# EAGLE schematic chipKIT Max32 (EAGLE 6.4)

## Sheet 1 of 5
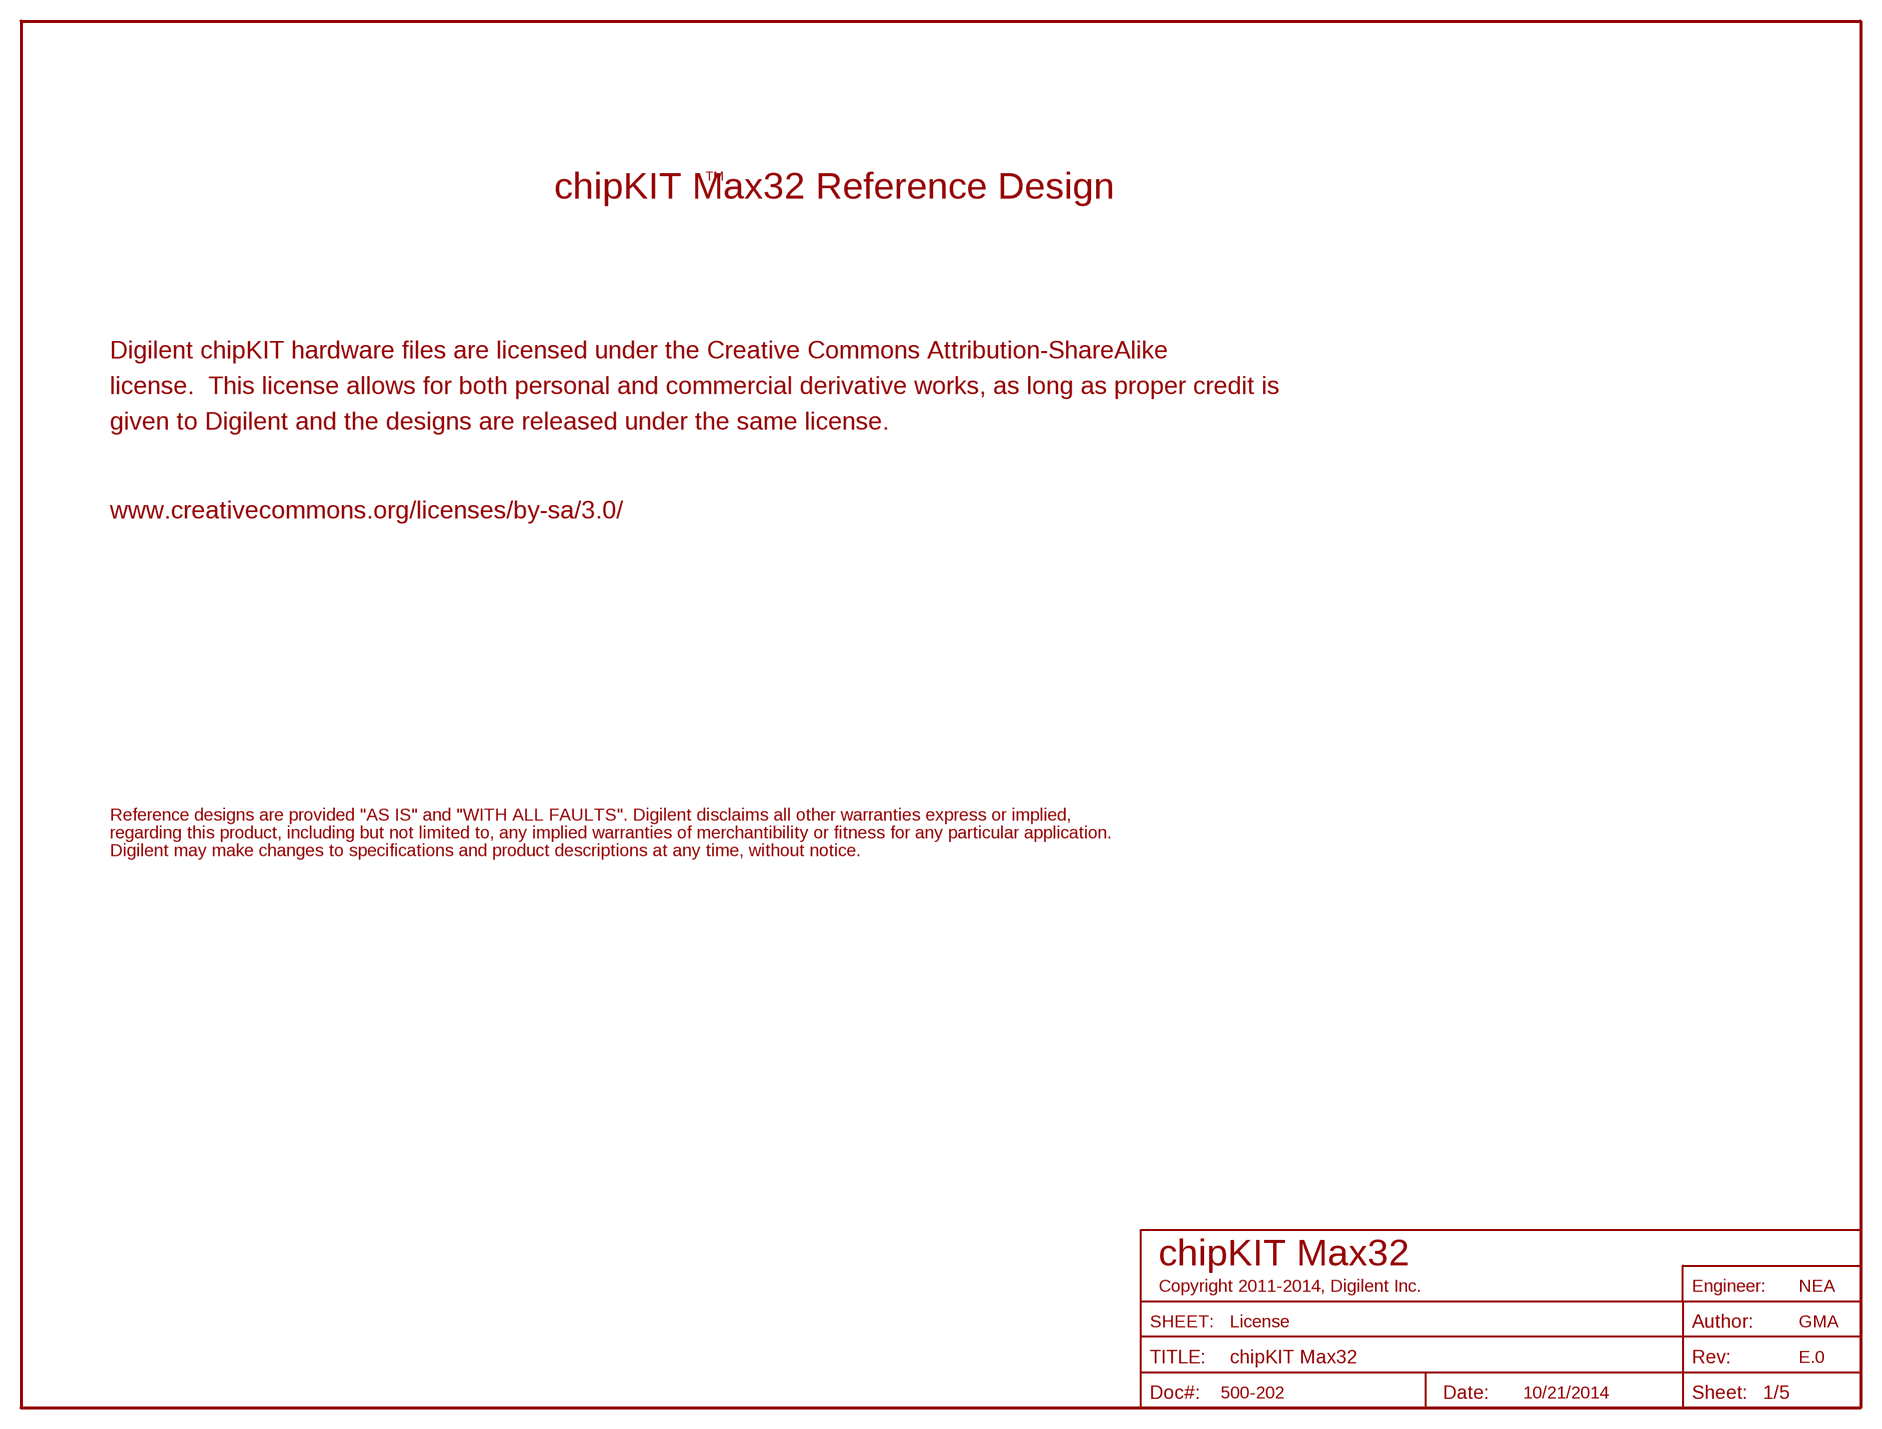
[diagram p0: schematic, sheet 1]

### Notes on the sheet
- TM
- chipKIT Max32 Reference Design
- Digilent chipKIT hardware files are licensed under the Creative Commons Attribution-ShareAlike
- license.  This license allows for both personal and commercial derivative works, as long as proper credit is
- given to Digilent and the designs are released under the same license.
- www.creativecommons.org/licenses/by-sa/3.0/
- Reference designs are provided "AS IS" and "WITH ALL FAULTS". Digilent disclaims all other warranties express or implied,
- regarding this product, including but not limited to, any implied warranties of merchantibility or fitness for any particular application.
- Digilent may make changes to specifications and product descriptions at any time, without notice.
- chipKIT Max32
- Copyright 2011-2014, Digilent Inc. | NEA
- License | GMA
- E.0
- 500-202 | 10/21/2014

## Sheet 2 of 5
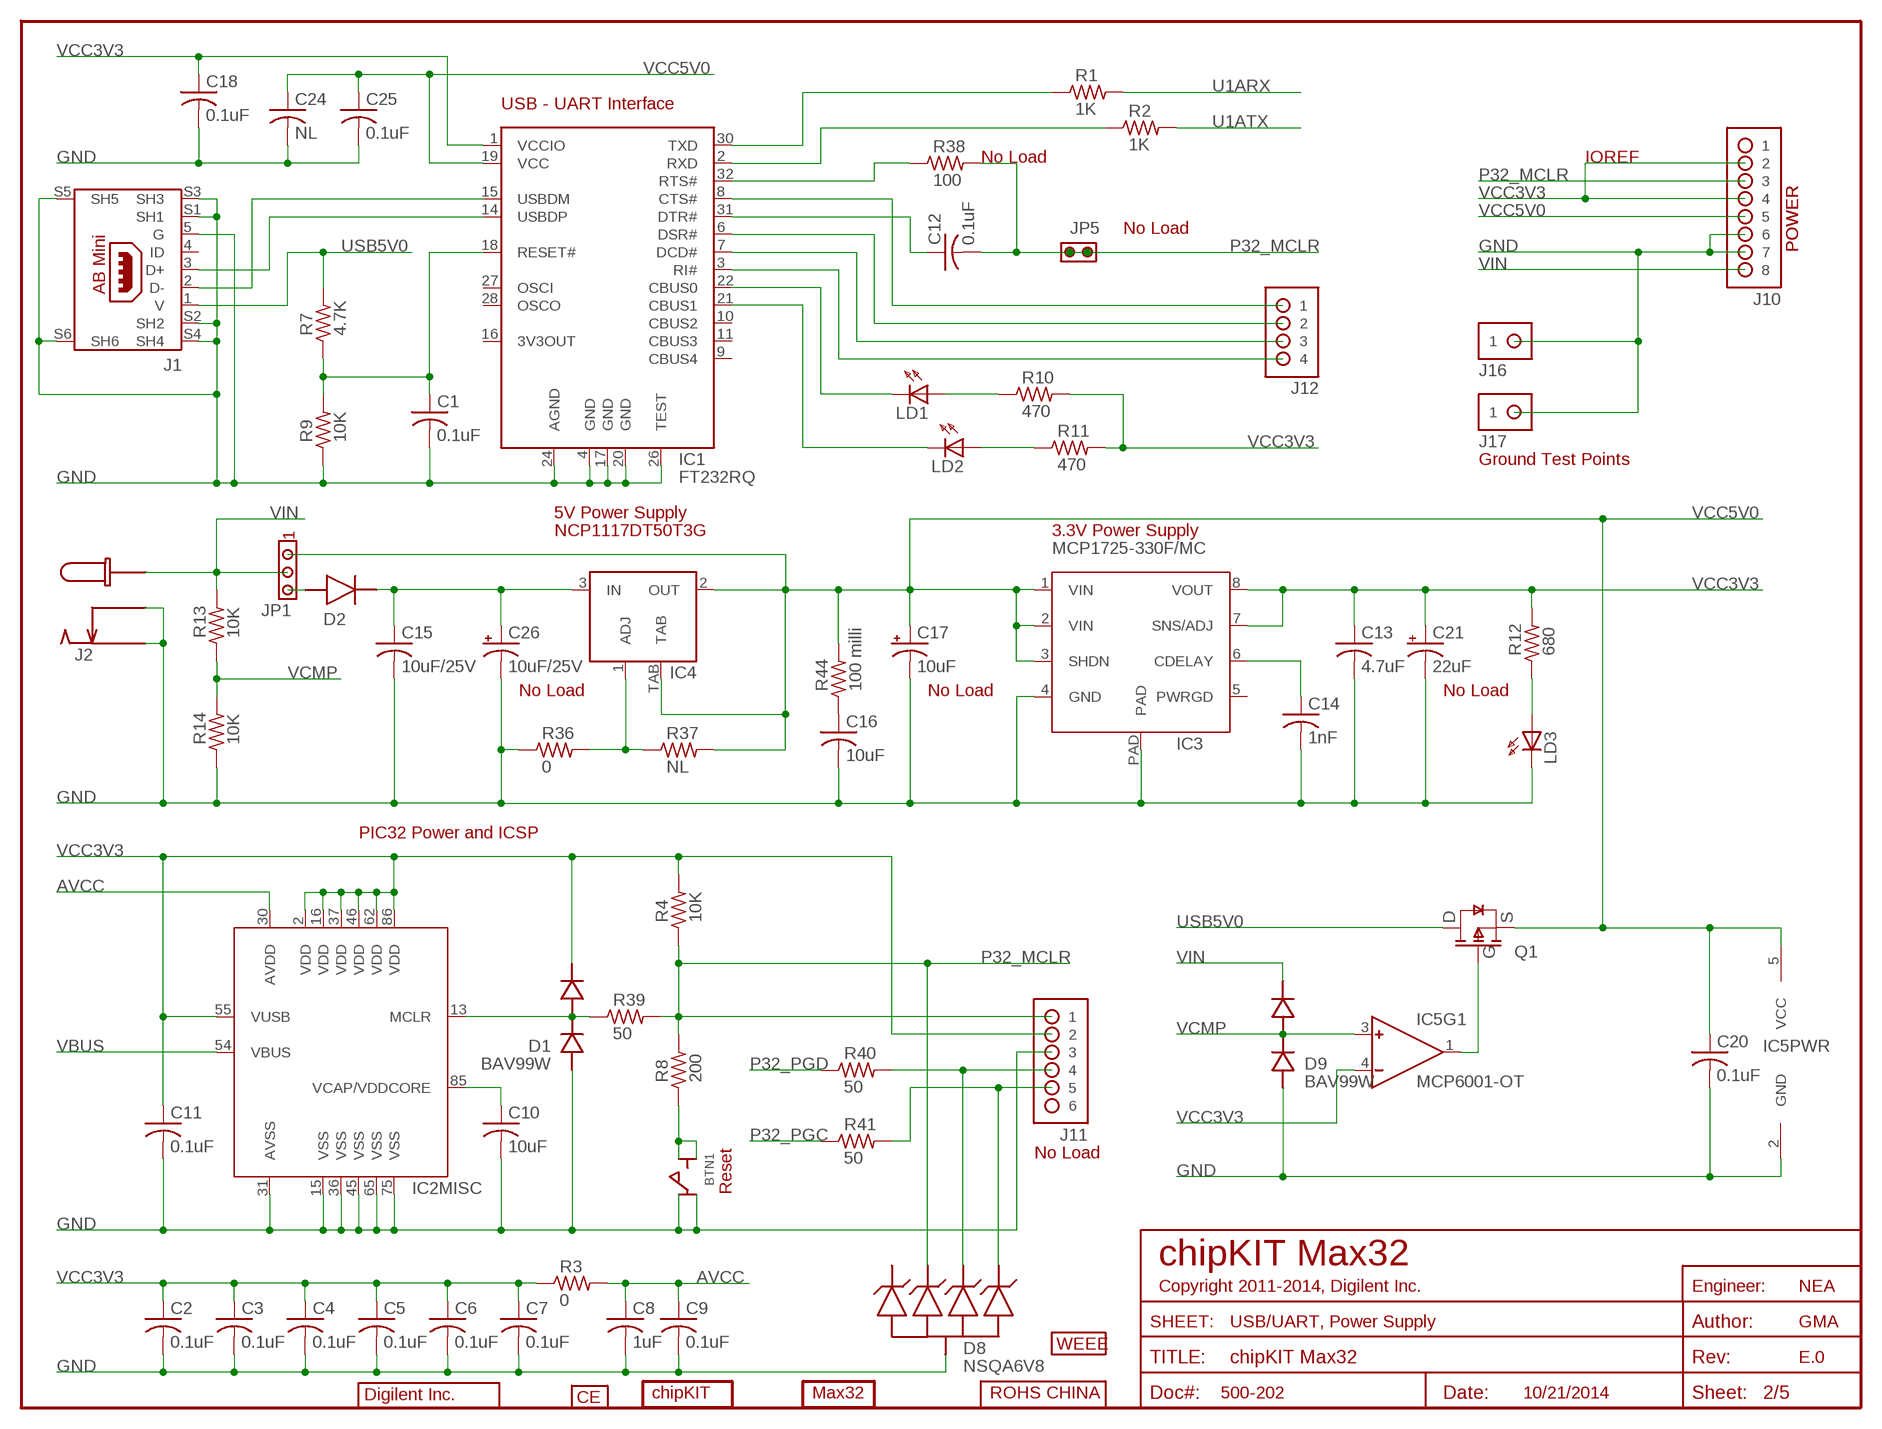
[diagram p1: schematic, sheet 2]

### Parts
BTN1  SW-P8008  [SW-P8008]
C1  0.1uF  CAP-S0402S  [C0402S]
C2  0.1uF  CAP-S0402S  [C0402S]
C3  0.1uF  CAP-S0402S  [C0402S]
C4  0.1uF  CAP-S0402S  [C0402S]
C5  0.1uF  CAP-S0402S  [C0402S]
C6  0.1uF  CAP-S0402S  [C0402S]
C7  0.1uF  CAP-S0402S  [C0402S]
C8  1uF  CAP-S0402S  [C0402S]
C9  0.1uF  CAP-S0402S  [C0402S]
C10  10uF  CAP-S0603S  [C0603S]
C11  0.1uF  CAP-S0402S  [C0402S]
C12  0.1uF  CAP-S0402S  [C0402S]
C13  4.7uF  CAP-S0603S  [C0603S]
C14  1nF  CAP-S0402S  [C0402S]
C15  10uF/25V  CAP-S0805S  [C0805S]
C16  10uF  CAP-S0603S  [C0603S]
C17  10uF  CPOL-SA  [CPOL3216]
C18  0.1uF  CAP-S0402S  [C0402S]
C20  0.1uF  CAP-S0402  [C0402]
C21  22uF  CPOL-SA  [CPOL3216]
C24  NL  CAP-S0603S  [C0603S]
C25  0.1uF  CAP-S0402S  [C0402S]
C26  10uF/25V  CPOL-SA  [CPOL3216]
D1  BAV99W  [SOT-323]
D2  B220A  DIODESMA  [SMA]
D8  NSQA6V8  [SOT-323-5]
D9  BAV99W  [SOT-323]
IC1  FT232RQ  [QFN32]
IC2  PIC32MX7X5FL-PT  [TQ100-PT]
IC3  MCP1725-330F/MC  MCP1725MC  [DFN8-MC]
IC4  NCP1117DT50T3G  LM1117MP  [SOT223]
IC5  MCP6001-OT  [SOT23-5-OT]
J1  USB-AB-MINI  [USB-AB-MINI]
J2  CON-COAX-KLD0202-S  [KLD-0202S]
J10  ST Female  HDR-1X8  [HDR-1X8]
J11  No Load  HDR-1X6-OFFSET  [HDR-1X6_OFFSET]
J12  HDR-1X4  [HDR-1X4]
J16  HDR-1X1  [HDR-1X1]
J17  HDR-1X1  [HDR-1X1]
JP1  JPR-1X3  [JPR-1X3]
JP5  No Load  JPR-1X2  [JPR-1X2]
LD1  LED-S0603-RED  LED-S0603  [D0603]
LD2  LED-S0603-RED  LED-S0603  [D0603]
LD3  LED-S0603-RED  LED-S0603  [D0603]
LOGO1  ROHS-CHINA-INV  [ROHS_CHINA_INV_LOGO]
LOGO2  WEEE-L  [WEEE_LOGO2]
LOGO4  MAX32_LOGO  [MAX32_LOGO]
LOGO5  CHIPKIT  [CHIPKIT_LOGO]
LOGO6  CE  [CE_LOGO]
LOGO7  DIGILENT_INC-BT-1500  [DIGILENT_BEYOND_1500_LOGO]
Q1  FDN340P  [SOT23]
R1  1K  RES-S0402S  [R0402S]
R2  1K  RES-S0402S  [R0402S]
R3  0  RES-S0603  [R0603]
R4  10K  RES-S0402S  [R0402S]
R7  4.7K  RES-S0402S  [R0402S]
R8  200  RES-S0402S  [R0402S]
R9  10K  RES-S0402S  [R0402S]
R10  470  RES-S0402S  [R0402S]
R11  470  RES-S0402S  [R0402S]
R12  680  RES-S0402S  [R0402S]
R13  10K  RES-S0402S  [R0402S]
R14  10K  RES-S0402S  [R0402S]
R36  0  RES-S0402S  [R0402S]
R37  NL  RES-S0402S  [R0402S]
R38  100  RES-S0402S  [R0402S]
R39  50  RES-S0402S  [R0402S]
R40  50  RES-S0402S  [R0402S]
R41  50  RES-S0402S  [R0402S]
R44  100 milli  RES-S0603S  [R0603S]

### Nets
AVCC: C8.1 C9.1 IC2.30(MISC:AVDD) R3.2
GND: BTN1.1A BTN1.2A C1.2 C2.2 C3.2 C4.2 C5.2 C6.2 C7.2 C8.2 C9.2 C10.2 C11.2 C13.2 C14.2 C15.2 C16.2 C17.- C18.2 C20.2 C21.- C24.2 C25.2 C26.- D1.1(CAT) D8.2(COM) D9.1(CAT) IC1.4(GND) IC1.17(GND) IC1.20(GND) IC1.24(AGND) IC1.26(TEST) IC2.15(MISC:VSS) IC2.31(MISC:AVSS) IC2.36(MISC:VSS) IC2.45(MISC:VSS) IC2.65(MISC:VSS) IC2.75(MISC:VSS) IC3.4(GND) IC3.PAD IC5.2(PWR:GND) J1.5(G) J1.S1(SH1) J1.S2(SH2) J1.S3(SH3) J1.S4(SH4) J1.S5(SH5) J1.S6(SH6) J2.2 J2.3 J10.6 J10.7 J11.3 J16.1 J17.1 LD3.C R9.1 R14.1 R36.1 ; also sheet 3,5
N$1: IC1.14(USBDP) J1.3(D+)
N$2: IC1.15(USBDM) J1.2(D-)
N$3: IC4.1(ADJ) R36.2 R37.1
N$4: IC1.30(TXD) R1.1
N$5: C10.1 IC2.85(MISC:VCAP/VDDCORE)
N$6: IC1.2(RXD) R2.1
N$8: C12.1 IC1.31(DTR#)
N$9: BTN1.1B BTN1.2B R8.1
N$10: IC1.8(CTS#) J12.1
N$13: IC1.6(DSR#) J12.2
N$14: IC1.7(DCD#) J12.3
N$15: IC1.3(RI#) J12.4
N$17: IC1.22(CBUS0) LD1.C
N$18: IC1.21(CBUS1) LD2.C
N$19: LD2.A R11.1
N$20: LD1.A R10.1
N$21: C14.1 IC3.6(CDELAY)
N$22: LD3.A R12.1
N$23: D2.A JP1.3
N$24: IC5.1(OUT) Q1.1(G)
N$26: C15.1 C26.+ D2.C IC4.3(IN)
N$29: C16.1 R44.1
N$30: C1.1 IC1.18(RESET#) R7.1 R9.2
N$31: D8.4(D3) J11.4 R40.2
N$32: IC1.32(RTS#) R38.1
N$33: D8.5(D4) J11.5 R41.2
N$38: D1.3(COM) IC2.13(MISC:MCLR) R39.1
P32_MCLR: C12.2 D8.3(D2) J10.3 J11.1 JP5.1 JP5.2 R4.1 R8.2 R38.2 R39.2
P32_PGC: R41.1 ; also sheet 3
P32_PGD: R40.1 ; also sheet 3
U1ARX: R1.2 ; also sheet 4,5
U1ATX: R2.2 ; also sheet 4,5
USB5V0: J1.1(V) Q1.3(D) R7.2
VBUS: IC2.54(MISC:VBUS) ; also sheet 5
VCC3V3: C2.1 C3.1 C4.1 C5.1 C6.1 C7.1 C11.1 C13.1 C18.1 C21.+ D1.2(AN) IC1.1(VCCIO) IC2.2(MISC:VDD) IC2.16(MISC:VDD) IC2.37(MISC:VDD) IC2.46(MISC:VDD) IC2.55(MISC:VUSB) IC2.62(MISC:VDD) IC2.86(MISC:VDD) IC3.7(SNS/ADJ) IC3.8(VOUT) IC5.4(IN-) J10.2 J10.4 J11.2 R3.1 R4.2 R10.2 R11.2 R12.2 ; also sheet 3,5
VCC5V0: C17.+ C20.1 C24.1 C25.1 IC1.19(VCC) IC3.1(VIN) IC3.2(VIN) IC3.3(SHDN) IC4.2(OUT) IC4.TAB IC5.5(PWR:VCC) J10.5 JP1.1 Q1.2(S) R37.2 R44.2 ; also sheet 5
VCMP: D9.3(COM) IC5.3(IN+) R13.1 R14.2
VIN: D9.2(AN) J2.1 J10.8 JP1.2 R13.2
Unconnected: D8.1(D1) IC1.9(CBUS4) IC1.10(CBUS2) IC1.11(CBUS3) IC1.16(3V3OUT) IC1.27(OSCI) IC1.28(OSCO) IC3.5(PWRGD) J1.4(ID) J10.1 J11.6

### Notes on the sheet
- USB - UART Interface
- No Load | IOREF
- No Load
- POWER | POWER
- Ground Test Points
- 5V Power Supply
- NCP1117DT50T3G | 3.3V Power Supply
- No Load | No Load | No Load
- PIC32 Power and ICSP
- No Load
- Reset
- chipKIT Max32
- Copyright 2011-2014, Digilent Inc. | NEA
- USB/UART, Power Supply | GMA
- E.0
- 500-202 | 10/21/2014

## Sheet 3 of 5
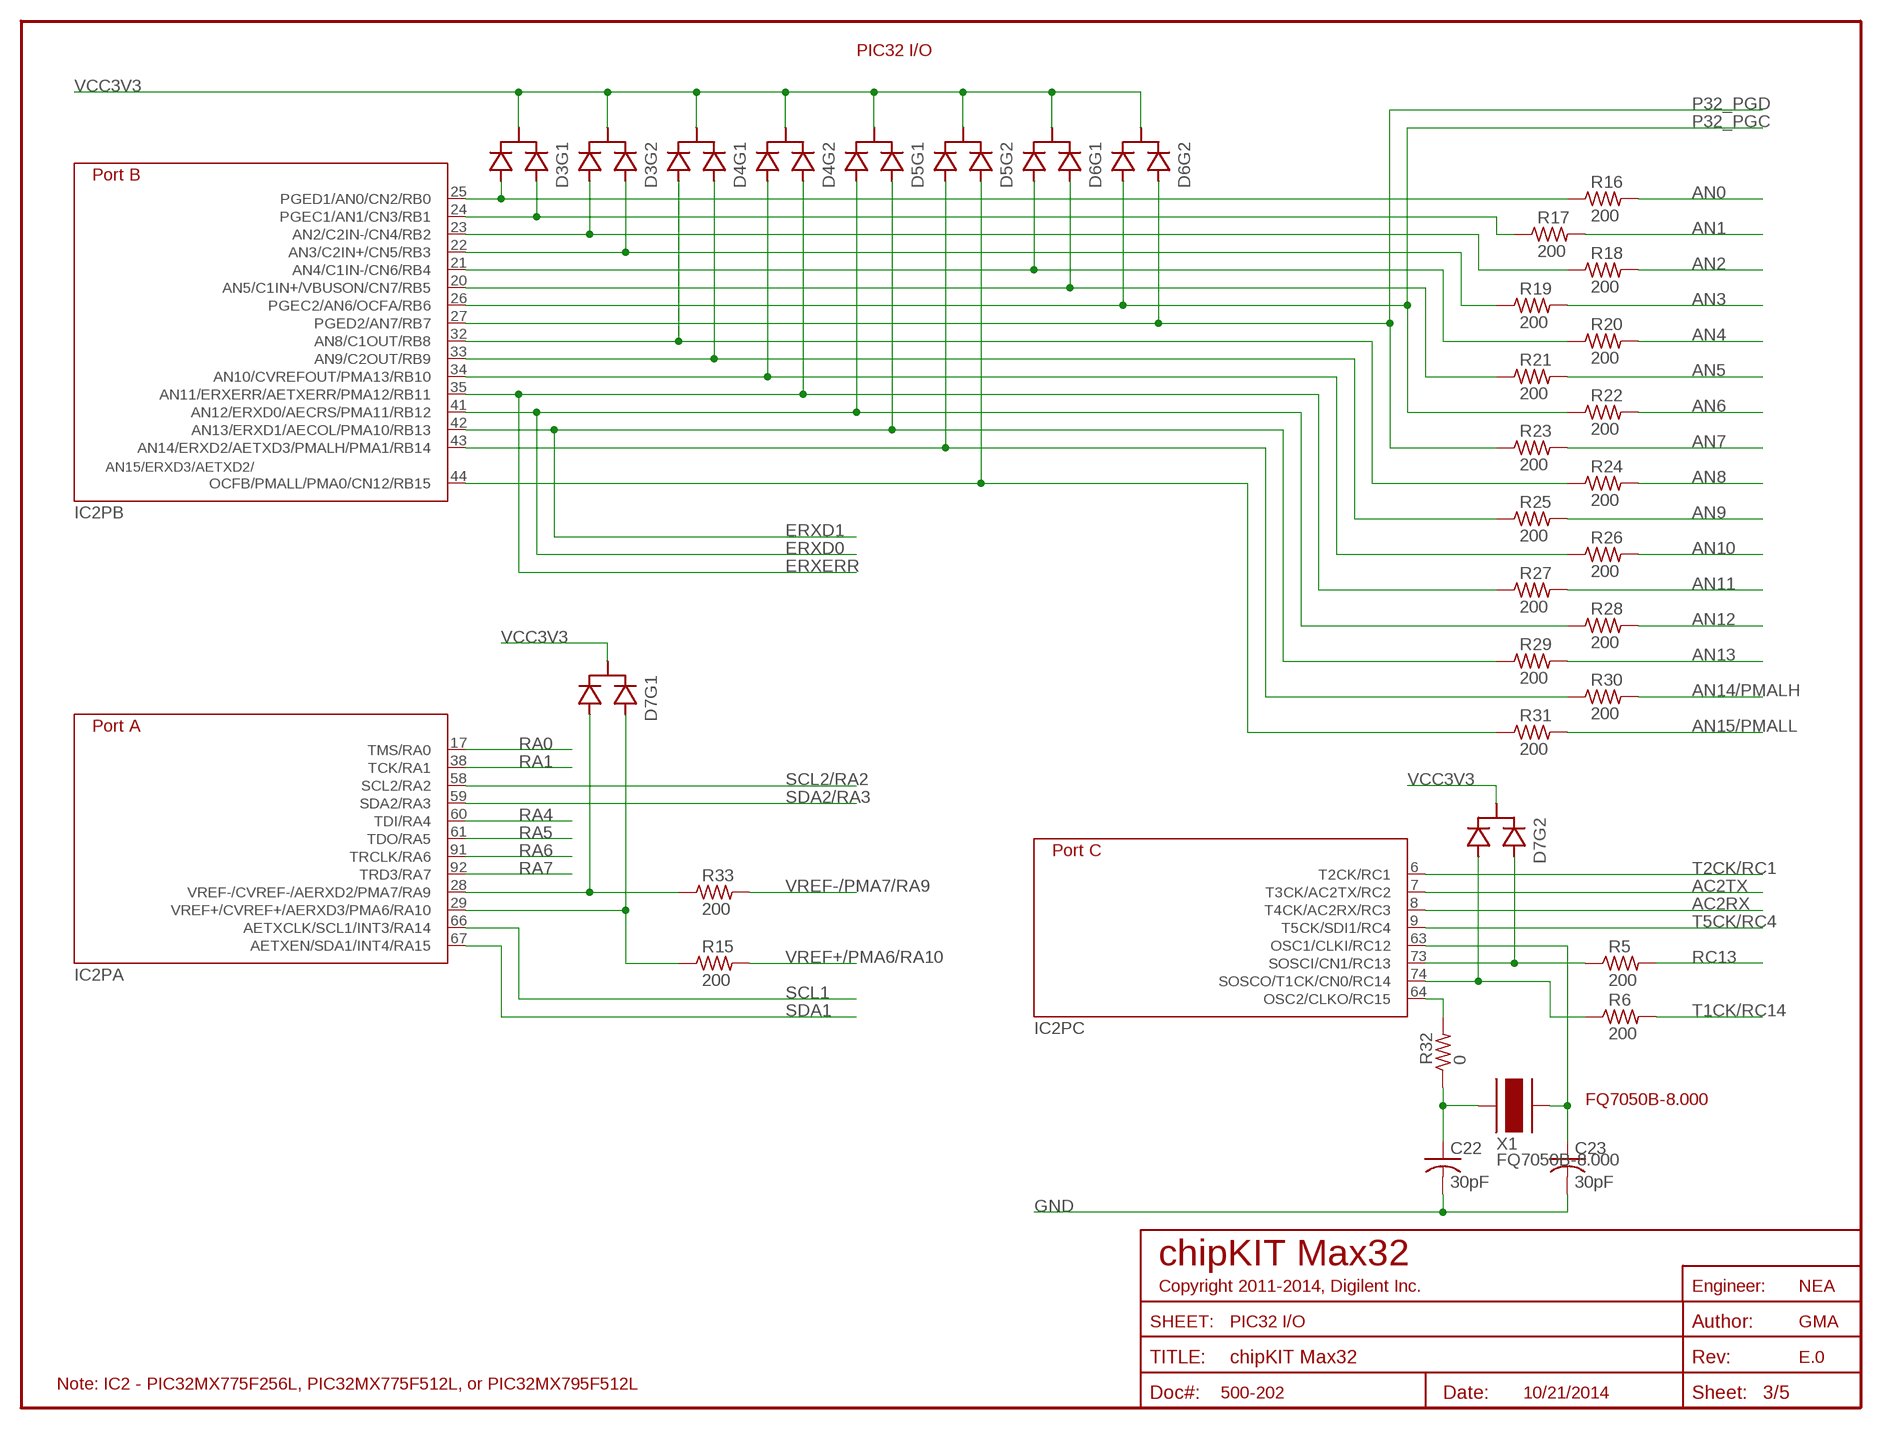
[diagram p2: schematic, sheet 3]

### Parts
C22  30pF  CAP-S0402S  [C0402S]
C23  30pF  CAP-S0402S  [C0402S]
D3  BAV70S  [SOT-363]
D4  BAV70S  [SOT-363]
D5  BAV70S  [SOT-363]
D6  BAV70S  [SOT-363]
D7  BAV70S  [SOT-363]
R5  200  RES-S0402S  [R0402S]
R6  200  RES-S0402S  [R0402S]
R15  200  RES-S0402S  [R0402S]
R16  200  RES-S0402S  [R0402S]
R17  200  RES-S0402S  [R0402S]
R18  200  RES-S0402S  [R0402S]
R19  200  RES-S0402S  [R0402S]
R20  200  RES-S0402S  [R0402S]
R21  200  RES-S0402S  [R0402S]
R22  200  RES-S0402S  [R0402S]
R23  200  RES-S0402S  [R0402S]
R24  200  RES-S0402S  [R0402S]
R25  200  RES-S0402S  [R0402S]
R26  200  RES-S0402S  [R0402S]
R27  200  RES-S0402S  [R0402S]
R28  200  RES-S0402S  [R0402S]
R29  200  RES-S0402S  [R0402S]
R30  200  RES-S0402S  [R0402S]
R31  200  RES-S0402S  [R0402S]
R32  0  RES-S0402S  [R0402S]
R33  200  RES-S0402S  [R0402S]
X1  FQ7050B-8.000  XTAL-FQ7050B  [FQ7050B]

### Nets
AC2RX: IC2.8(PC:T4CK/AC2RX/RC3) ; also sheet 5
AC2TX: IC2.7(PC:T3CK/AC2TX/RC2) ; also sheet 5
AN0: R16.2 ; also sheet 5
AN0-R: D3.1(A1) IC2.25(PB:PGED1/AN0/CN2/RB0) R16.1
AN1: R17.2 ; also sheet 5
AN1-R: D3.2(A2) IC2.24(PB:PGEC1/AN1/CN3/RB1) R17.1
AN2: R18.2 ; also sheet 5
AN3: R19.2 ; also sheet 5
AN4: R20.2 ; also sheet 5
AN5: R21.2 ; also sheet 5
AN6: R22.2 ; also sheet 5
AN7: R23.2 ; also sheet 5
AN8: R24.2 ; also sheet 5
AN9: R25.2 ; also sheet 5
AN10: R26.2 ; also sheet 5
AN11: R27.2 ; also sheet 5
AN12: R28.2 ; also sheet 5
AN13: R29.2 ; also sheet 5
AN14/PMALH: R30.2 ; also sheet 5
AN15/PMALL: R31.2 ; also sheet 5
ERXD0: D5.1(A1) IC2.41(PB:AN12/ERXD0/AECRS/PMA11/RB12) R28.1 ; also sheet 5
ERXD1: D5.2(A2) IC2.42(PB:AN13/ERXD1/AECOL/PMA10/RB13) R29.1 ; also sheet 5
ERXERR: D4.5(A2) IC2.35(PB:AN11/ERXERR/AETXERR/PMA12/RB11) R27.1 ; also sheet 5
GND: C22.2 C23.2 ; also sheet 2,5
N$7: D7.5(A2) IC2.73(PC:SOSCI/CN1/RC13) R5.1
N$11: D7.4(A1) IC2.74(PC:SOSCO/T1CK/CN0/RC14) R6.1
N$25: D7.1(A1) IC2.28(PA:VREF-/CVREF-/AERXD2/PMA7/RA9) R33.1
N$35: D7.2(A2) IC2.29(PA:VREF+/CVREF+/AERXD3/PMA6/RA10) R15.1
N$37: IC2.64(PC:OSC2/CLKO/RC15) R32.2
N$39: C22.1 R32.1 X1.1
N$40: D3.4(A1) IC2.23(PB:AN2/C2IN-/CN4/RB2) R18.1
N$41: C23.1 IC2.63(PC:OSC1/CLKI/RC12) X1.3
N$42: D3.5(A2) IC2.22(PB:AN3/C2IN+/CN5/RB3) R19.1
N$44: D6.1(A1) IC2.21(PB:AN4/C1IN-/CN6/RB4) R20.1
N$46: D6.2(A2) IC2.20(PB:AN5/C1IN+/VBUSON/CN7/RB5) R21.1
N$52: D4.1(A1) IC2.32(PB:AN8/C1OUT/RB8) R24.1
N$54: D4.2(A2) IC2.33(PB:AN9/C2OUT/RB9) R25.1
N$56: D4.4(A1) IC2.34(PB:AN10/CVREFOUT/PMA13/RB10) R26.1
N$64: D5.4(A1) IC2.43(PB:AN14/ERXD2/AETXD3/PMALH/PMA1/RB14) R30.1
N$66: D5.5(A2) IC2.44(PB:OCFB/PMALL/PMA0/CN12/RB15) R31.1
P32_PGC: D6.4(A1) IC2.26(PB:PGEC2/AN6/OCFA/RB6) R22.1 ; also sheet 2
P32_PGD: D6.5(A2) IC2.27(PB:PGED2/AN7/RB7) R23.1 ; also sheet 2
RA0: IC2.17(PA:TMS/RA0) ; also sheet 5
RA1: IC2.38(PA:TCK/RA1) ; also sheet 5
RA4: IC2.60(PA:TDI/RA4) ; also sheet 5
RA5: IC2.61(PA:TDO/RA5) ; also sheet 5
RA6: IC2.91(PA:TRCLK/RA6) ; also sheet 5
RA7: IC2.92(PA:TRD3/RA7) ; also sheet 5
RC13: R5.2 ; also sheet 5
SCL1: IC2.66(PA:AETXCLK/SCL1/INT3/RA14) ; also sheet 5
SCL2/RA2: IC2.58(PA:SCL2/RA2) ; also sheet 5
SDA1: IC2.67(PA:AETXEN/SDA1/INT4/RA15) ; also sheet 5
SDA2/RA3: IC2.59(PA:SDA2/RA3) ; also sheet 5
T1CK/RC14: R6.2 ; also sheet 5
T2CK/RC1: IC2.6(PC:T2CK/RC1) ; also sheet 5
T5CK/RC4: IC2.9(PC:T5CK/SDI1/RC4) ; also sheet 5
VCC3V3: D3.3(K) D3.6(K) D4.3(K) D4.6(K) D5.3(K) D5.6(K) D6.3(K) D6.6(K) D7.3(K) D7.6(K) ; also sheet 2,5
VREF+/PMA6/RA10: R15.2 ; also sheet 5
VREF-/PMA7/RA9: R33.2 ; also sheet 5

### Notes on the sheet
- PIC32 I/O
- FQ7050B-8.000
- chipKIT Max32
- Copyright 2011-2014, Digilent Inc. | NEA
- PIC32 I/O | GMA
- E.0
- Note: IC2 - PIC32MX775F256L, PIC32MX775F512L, or PIC32MX795F512L
- 500-202 | 10/21/2014

## Sheet 4 of 5
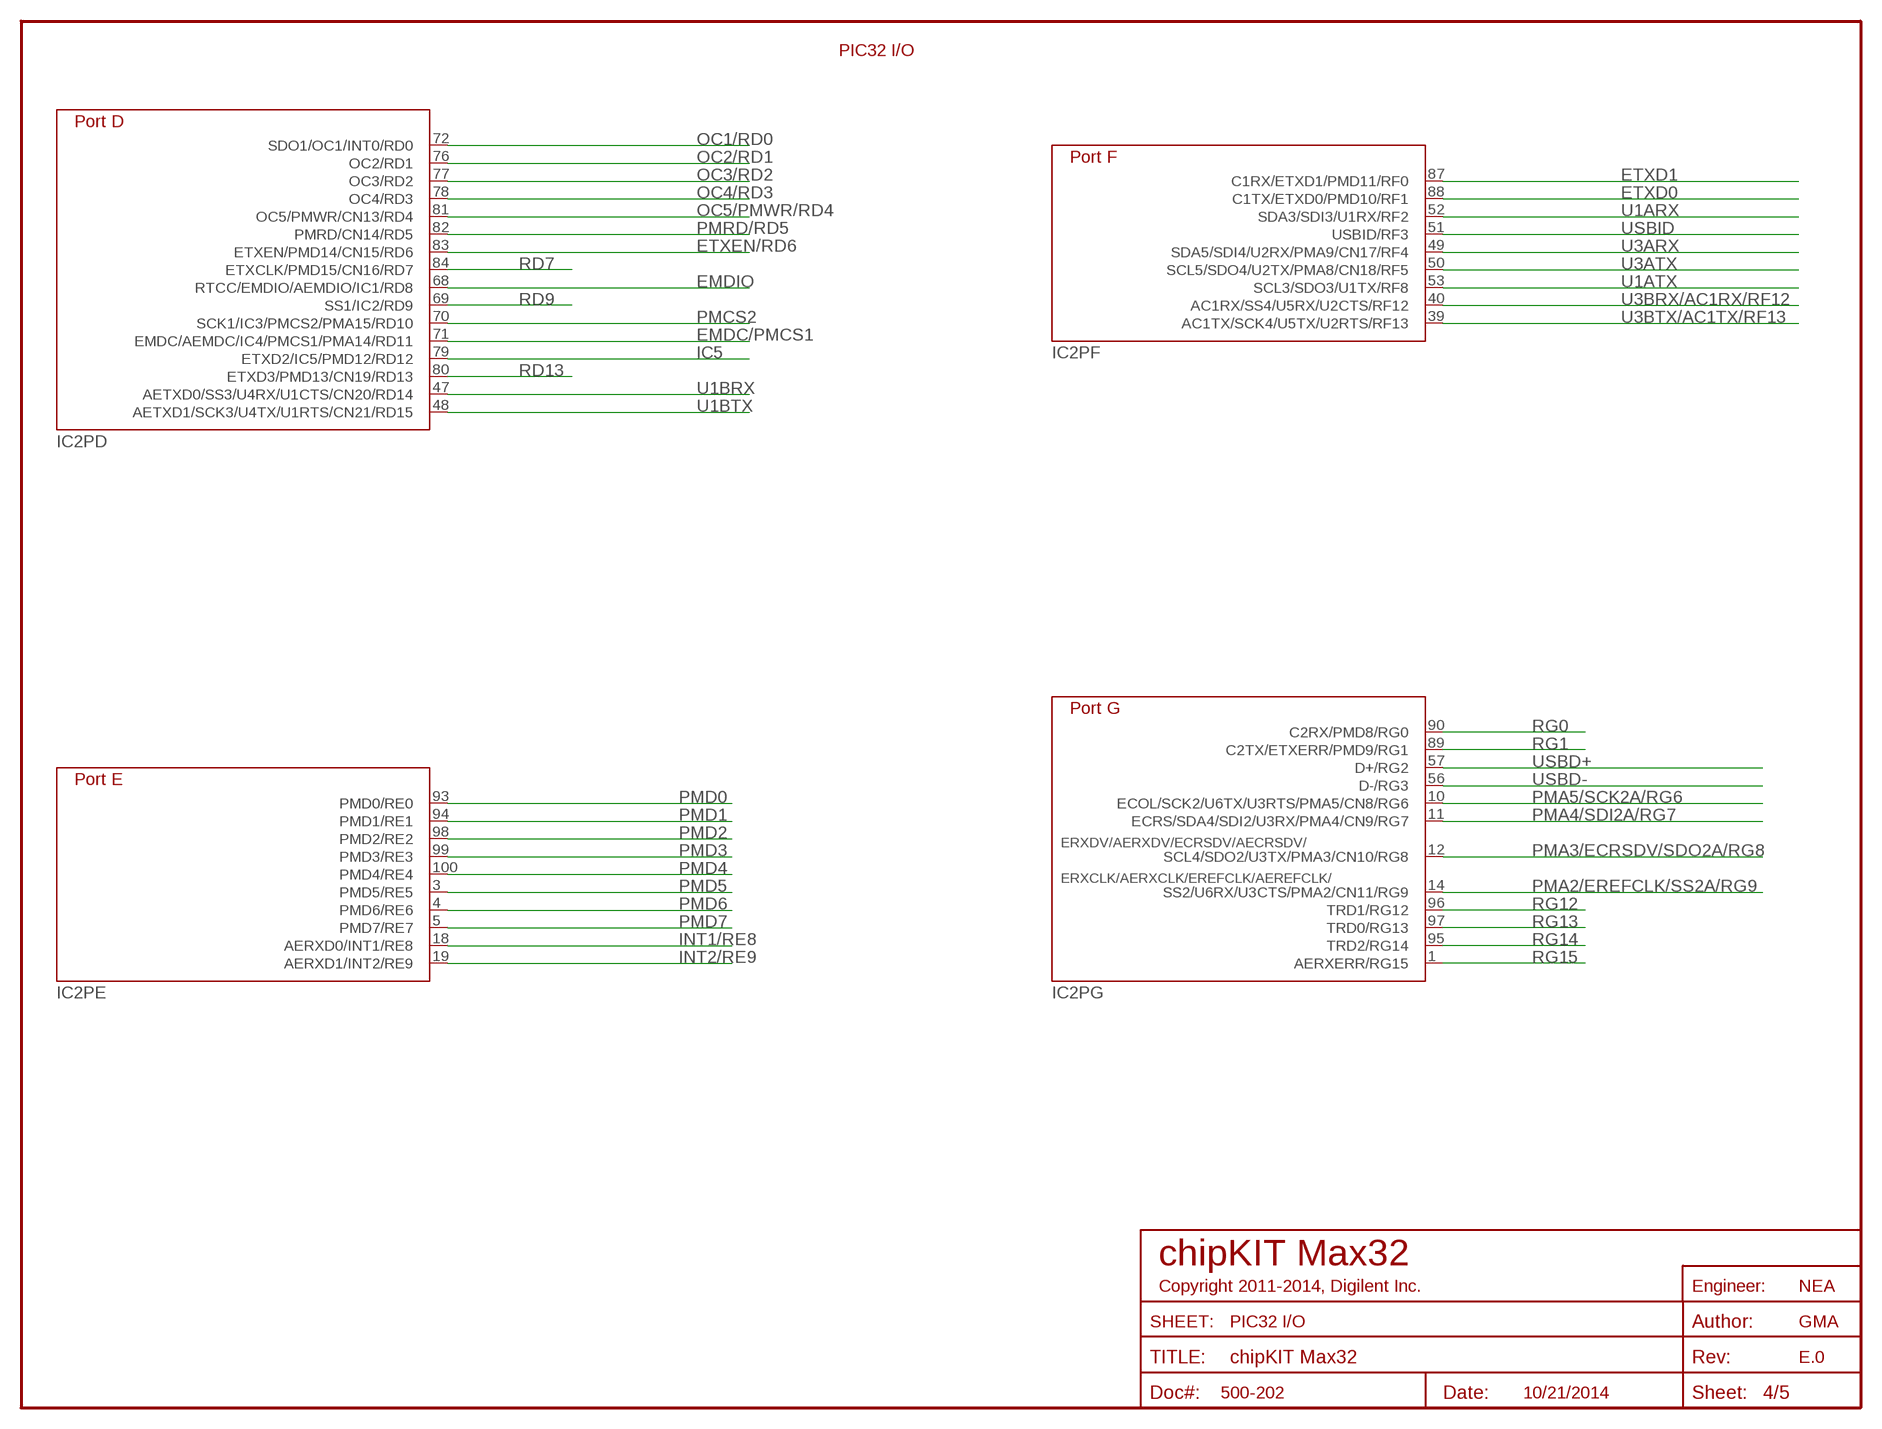
[diagram p3: schematic, sheet 4]

### Nets
EMDC/PMCS1: IC2.71(PD:EMDC/AEMDC/IC4/PMCS1/PMA14/RD11) ; also sheet 5
EMDIO: IC2.68(PD:RTCC/EMDIO/AEMDIO/IC1/RD8) ; also sheet 5
ETXD0: IC2.88(PF:C1TX/ETXD0/PMD10/RF1) ; also sheet 5
ETXD1: IC2.87(PF:C1RX/ETXD1/PMD11/RF0) ; also sheet 5
ETXEN/RD6: IC2.83(PD:ETXEN/PMD14/CN15/RD6) ; also sheet 5
IC5: IC2.79(PD:ETXD2/IC5/PMD12/RD12) ; also sheet 5
INT1/RE8: IC2.18(PE:AERXD0/INT1/RE8) ; also sheet 5
INT2/RE9: IC2.19(PE:AERXD1/INT2/RE9) ; also sheet 5
OC1/RD0: IC2.72(PD:SDO1/OC1/INT0/RD0) ; also sheet 5
OC2/RD1: IC2.76(PD:OC2/RD1) ; also sheet 5
OC3/RD2: IC2.77(PD:OC3/RD2) ; also sheet 5
OC4/RD3: IC2.78(PD:OC4/RD3) ; also sheet 5
OC5/PMWR/RD4: IC2.81(PD:OC5/PMWR/CN13/RD4) ; also sheet 5
PMA2/EREFCLK/SS2A/RG9: IC2.14(PG:SS2/U6RX/U3CTS/PMA2/CN11/RG9) ; also sheet 5
PMA3/ECRSDV/SDO2A/RG8: IC2.12(PG:SCL4/SDO2/U3TX/PMA3/CN10/RG8) ; also sheet 5
PMA4/SDI2A/RG7: IC2.11(PG:ECRS/SDA4/SDI2/U3RX/PMA4/CN9/RG7) ; also sheet 5
PMA5/SCK2A/RG6: IC2.10(PG:ECOL/SCK2/U6TX/U3RTS/PMA5/CN8/RG6) ; also sheet 5
PMCS2: IC2.70(PD:SCK1/IC3/PMCS2/PMA15/RD10) ; also sheet 5
PMD0: IC2.93(PE:PMD0/RE0) ; also sheet 5
PMD1: IC2.94(PE:PMD1/RE1) ; also sheet 5
PMD2: IC2.98(PE:PMD2/RE2) ; also sheet 5
PMD3: IC2.99(PE:PMD3/RE3) ; also sheet 5
PMD4: IC2.100(PE:PMD4/RE4) ; also sheet 5
PMD5: IC2.3(PE:PMD5/RE5) ; also sheet 5
PMD6: IC2.4(PE:PMD6/RE6) ; also sheet 5
PMD7: IC2.5(PE:PMD7/RE7) ; also sheet 5
PMRD/RD5: IC2.82(PD:PMRD/CN14/RD5) ; also sheet 5
RD7: IC2.84(PD:ETXCLK/PMD15/CN16/RD7) ; also sheet 5
RD9: IC2.69(PD:SS1/IC2/RD9) ; also sheet 5
RD13: IC2.80(PD:ETXD3/PMD13/CN19/RD13) ; also sheet 5
RG0: IC2.90(PG:C2RX/PMD8/RG0) ; also sheet 5
RG1: IC2.89(PG:C2TX/ETXERR/PMD9/RG1) ; also sheet 5
RG12: IC2.96(PG:TRD1/RG12) ; also sheet 5
RG13: IC2.97(PG:TRD0/RG13) ; also sheet 5
RG14: IC2.95(PG:TRD2/RG14) ; also sheet 5
RG15: IC2.1(PG:AERXERR/RG15) ; also sheet 5
U1ARX: IC2.52(PF:SDA3/SDI3/U1RX/RF2) ; also sheet 2,5
U1ATX: IC2.53(PF:SCL3/SDO3/U1TX/RF8) ; also sheet 2,5
U1BRX: IC2.47(PD:AETXD0/SS3/U4RX/U1CTS/CN20/RD14) ; also sheet 5
U1BTX: IC2.48(PD:AETXD1/SCK3/U4TX/U1RTS/CN21/RD15) ; also sheet 5
U3ARX: IC2.49(PF:SDA5/SDI4/U2RX/PMA9/CN17/RF4) ; also sheet 5
U3ATX: IC2.50(PF:SCL5/SDO4/U2TX/PMA8/CN18/RF5) ; also sheet 5
U3BRX/AC1RX/RF12: IC2.40(PF:AC1RX/SS4/U5RX/U2CTS/RF12) ; also sheet 5
U3BTX/AC1TX/RF13: IC2.39(PF:AC1TX/SCK4/U5TX/U2RTS/RF13) ; also sheet 5
USBD+: IC2.57(PG:D+/RG2) ; also sheet 5
USBD-: IC2.56(PG:D-/RG3) ; also sheet 5
USBID: IC2.51(PF:USBID/RF3) ; also sheet 5

### Notes on the sheet
- PIC32 I/O
- chipKIT Max32
- Copyright 2011-2014, Digilent Inc. | NEA
- PIC32 I/O | GMA
- E.0
- 500-202 | 10/21/2014

## Sheet 5 of 5
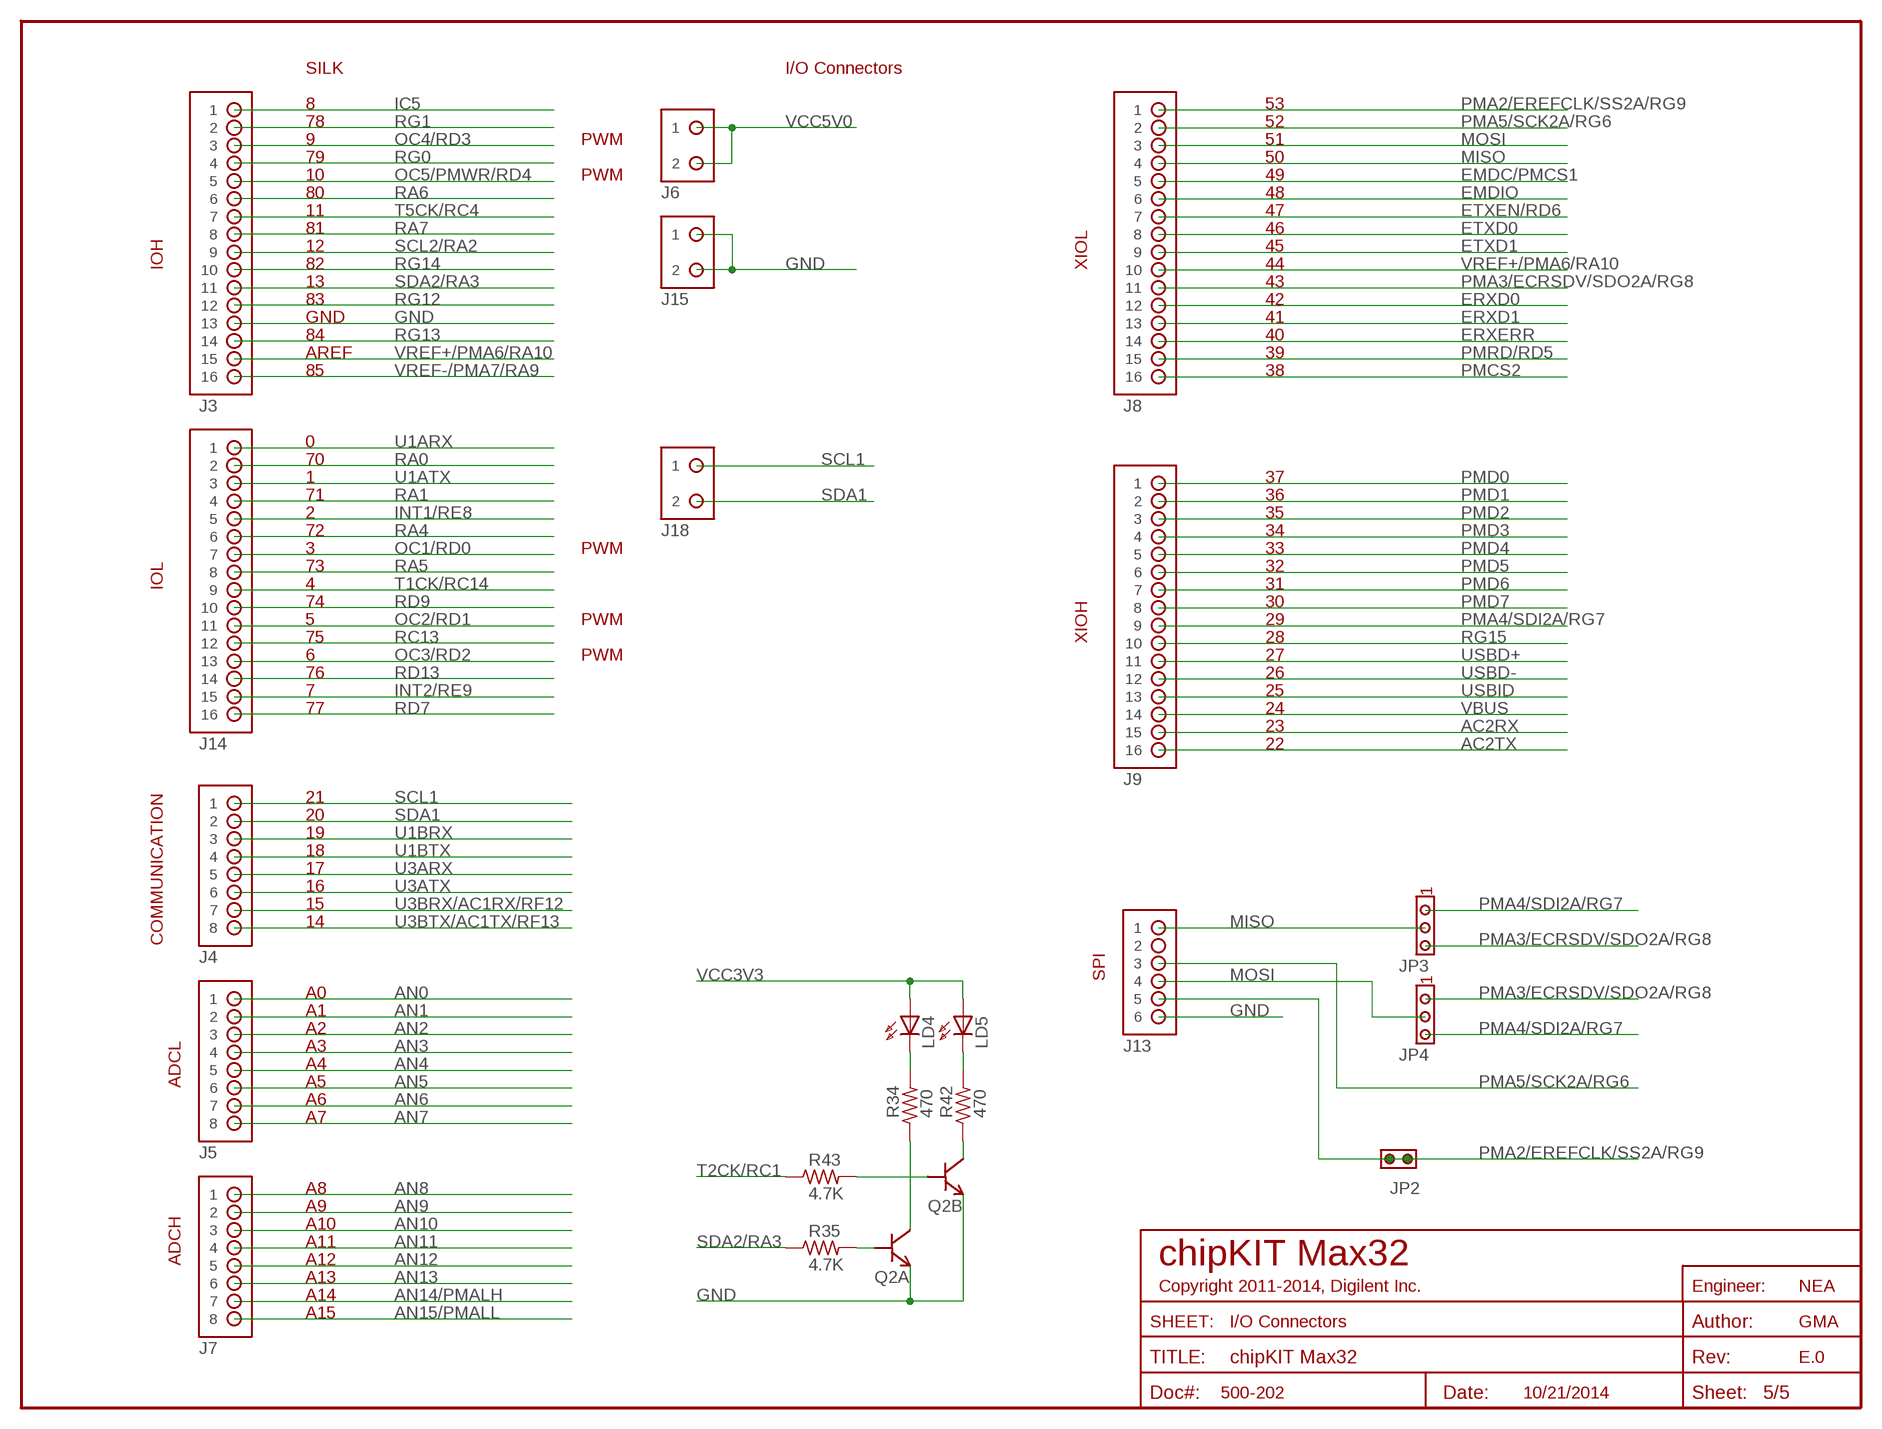
[diagram p4: schematic, sheet 5]

### Parts
J3  HDR-2X8  [HDR-2X8]
J4  HDR-1X8  [HDR-1X8]
J5  HDR-1X8  [HDR-1X8]
J6  HDR-1X2  [HDR-1X2]
J7  HDR-1X8  [HDR-1X8]
J8  HDR-2X8  [HDR-2X8]
J9  HDR-2X8  [HDR-2X8]
J13  HDR-2X3  [HDR-2X3]
J14  HDR-2X8  [HDR-2X8]
J15  HDR-1X2  [HDR-1X2]
J18  ST FEMALE  HDR-1X2  [HDR-1X2]
JP2  JPR-1X2  [JPR-1X2]
JP3  JPR-1X3  [JPR-1X3]
JP4  JPR-1X3  [JPR-1X3]
LD4  LED-S0603-GRN  LED-S0603  [D0603]
LD5  LED-S0603  [D0603]
Q2  MBT3904DW1T1  [SOT-363]
R34  470  RES-S0402S  [R0402S]
R35  4.7K  RES-S0402S  [R0402S]
R42  470  RES-S0402S  [R0402S]
R43  4.7K  RES-S0402S  [R0402S]

### Nets
AC2RX: J9.15 ; also sheet 3
AC2TX: J9.16 ; also sheet 3
AN0: J5.1 ; also sheet 3
AN1: J5.2 ; also sheet 3
AN2: J5.3 ; also sheet 3
AN3: J5.4 ; also sheet 3
AN4: J5.5 ; also sheet 3
AN5: J5.6 ; also sheet 3
AN6: J5.7 ; also sheet 3
AN7: J5.8 ; also sheet 3
AN8: J7.1 ; also sheet 3
AN9: J7.2 ; also sheet 3
AN10: J7.3 ; also sheet 3
AN11: J7.4 ; also sheet 3
AN12: J7.5 ; also sheet 3
AN13: J7.6 ; also sheet 3
AN14/PMALH: J7.7 ; also sheet 3
AN15/PMALL: J7.8 ; also sheet 3
EMDC/PMCS1: J8.5 ; also sheet 4
EMDIO: J8.6 ; also sheet 4
ERXD0: J8.12 ; also sheet 3
ERXD1: J8.13 ; also sheet 3
ERXERR: J8.14 ; also sheet 3
ETXD0: J8.8 ; also sheet 4
ETXD1: J8.9 ; also sheet 4
ETXEN/RD6: J8.7 ; also sheet 4
GND: J3.13 J13.6 J15.1 J15.2 Q2.1(B:E) Q2.4(A:E) ; also sheet 2,3
IC5: J3.1 ; also sheet 4
INT1/RE8: J14.5 ; also sheet 4
INT2/RE9: J14.15 ; also sheet 4
MISO: J8.4 J13.1 JP3.2
MOSI: J8.3 J13.4 JP4.2
N$12: Q2.2(B:B) R43.2
N$16: LD5.C R42.2
N$27: Q2.6(B:C) R42.1
N$28: Q2.3(A:C) R34.1
N$34: Q2.5(A:B) R35.2
N$36: LD4.C R34.2
OC1/RD0: J14.7 ; also sheet 4
OC2/RD1: J14.11 ; also sheet 4
OC3/RD2: J14.13 ; also sheet 4
OC4/RD3: J3.3 ; also sheet 4
OC5/PMWR/RD4: J3.5 ; also sheet 4
PMA2/EREFCLK/SS2A/RG9: J8.1 J13.5 JP2.1 JP2.2 ; also sheet 4
PMA3/ECRSDV/SDO2A/RG8: J8.11 JP3.3 JP4.1 ; also sheet 4
PMA4/SDI2A/RG7: J9.9 JP3.1 JP4.3 ; also sheet 4
PMA5/SCK2A/RG6: J8.2 J13.3 ; also sheet 4
PMCS2: J8.16 ; also sheet 4
PMD0: J9.1 ; also sheet 4
PMD1: J9.2 ; also sheet 4
PMD2: J9.3 ; also sheet 4
PMD3: J9.4 ; also sheet 4
PMD4: J9.5 ; also sheet 4
PMD5: J9.6 ; also sheet 4
PMD6: J9.7 ; also sheet 4
PMD7: J9.8 ; also sheet 4
PMRD/RD5: J8.15 ; also sheet 4
RA0: J14.2 ; also sheet 3
RA1: J14.4 ; also sheet 3
RA4: J14.6 ; also sheet 3
RA5: J14.8 ; also sheet 3
RA6: J3.6 ; also sheet 3
RA7: J3.8 ; also sheet 3
RC13: J14.12 ; also sheet 3
RD7: J14.16 ; also sheet 4
RD9: J14.10 ; also sheet 4
RD13: J14.14 ; also sheet 4
RG0: J3.4 ; also sheet 4
RG1: J3.2 ; also sheet 4
RG12: J3.12 ; also sheet 4
RG13: J3.14 ; also sheet 4
RG14: J3.10 ; also sheet 4
RG15: J9.10 ; also sheet 4
SCL1: J4.1 J18.1 ; also sheet 3
SCL2/RA2: J3.9 ; also sheet 3
SDA1: J4.2 J18.2 ; also sheet 3
SDA2/RA3: J3.11 R35.1 ; also sheet 3
T1CK/RC14: J14.9 ; also sheet 3
T2CK/RC1: R43.1 ; also sheet 3
T5CK/RC4: J3.7 ; also sheet 3
U1ARX: J14.1 ; also sheet 2,4
U1ATX: J14.3 ; also sheet 2,4
U1BRX: J4.3 ; also sheet 4
U1BTX: J4.4 ; also sheet 4
U3ARX: J4.5 ; also sheet 4
U3ATX: J4.6 ; also sheet 4
U3BRX/AC1RX/RF12: J4.7 ; also sheet 4
U3BTX/AC1TX/RF13: J4.8 ; also sheet 4
USBD+: J9.11 ; also sheet 4
USBD-: J9.12 ; also sheet 4
USBID: J9.13 ; also sheet 4
VBUS: J9.14 ; also sheet 2
VCC3V3: LD4.A LD5.A ; also sheet 2,3
VCC5V0: J6.1 J6.2 ; also sheet 2
VREF+/PMA6/RA10: J3.15 J8.10 ; also sheet 3
VREF-/PMA7/RA9: J3.16 ; also sheet 3
Unconnected: J13.2

### Notes on the sheet
- SILK | I/O Connectors
- 8 | 53
- 78 | 52
- 9 | PWM | 51
- 79 | 50
- 10 | PWM | 49
- 80 | 48
- 11 | 47
- 81 | 46
- 12 | 45
- IOH | 82 | XIOL | 44
- 13 | 43
- 83 | 42
- GND | 41
- 84 | 40
- AREF | 39
- 85 | 38
- 0
- 70
- 1 | 37
- 71 | 36
- 2 | 35
- 72 | 34
- 3 | PWM | 33
- 73 | 32
- IOL | 4 | 31
- 74 | 30
- 5 | PWM | 29
- 75 | XIOH | 28
- 6 | PWM | 27
- 76 | 26
- 7 | 25
- 77 | 24
- 23
- 22
- 21
- 20
- 19
- 18
- 17
- 16
- 15
- 14
- COMMUNICATION
- SPI
- A0
- A1
- A2
- A3
- A4
- ADCL | A5
- A6
- A7
- A8
- A9
- A10
- A11
- ADCH | A12 | chipKIT Max32
- A13
- Copyright 2011-2014, Digilent Inc. | NEA
- A14
- A15
- I/O Connectors | GMA
- E.0
- 500-202 | 10/21/2014

## Library data of the parts
BTN1 = Mechanical:SW-P8008: 153-000: SPST, Push button, momentary
C1-C16 C18 C20 C22-C25 = Discrete:CAP: Capacitor
C17 C21 C26 = Discrete:CPOL: Capacitor
D1 D9 = Discrete:BAV99W: BAV99W Dual Surface Mount Switching Diode
D2 = Discrete:DIODE: Diode
D3-D7 = Discrete:BAV70S: High Speed Switching Diode Array
D8 = Discrete:NSQA6V8: Low Capacitance Quad ESD Protection Array
IC1 = IC:FT232R: FTDI USB UART Serial Converter
IC2 = Microchip:PIC32MX7X5F*L: High Performance, USB, CAN and Ethernet 32-Bit Flash Microcontroller
IC3 = Microchip:MCP1725MC: 500mA Low Voltage, Low Quiescent Current LDO Regulator
IC4 = IC:LM1117: LM1117 Adjustable voltage regulator, 1.2V dropout
IC5 = Microchip:MCP6001: 1 Mhz Low Power Op Amp
J1 = Mechanical:USB-AB-MINI: Kycon KMAB-SMT-5S Mini USB AB type connector
J2 = Mechanical:CON-COAX: COAX Power Connector
J3 J8 J9 J14 = Mechanical:HDR-2X8: 100mil 2x8 header
J4 J5 J7 J10 = Mechanical:HDR-1X8
J6 J15 J18 = Mechanical:HDR-1X2
J11 = Mechanical:HDR-1X6-OFFSET: 42 mil hole pattern with 16mil offset for jtag connector
J12 = Mechanical:HDR-1X4
J13 = Mechanical:HDR-2X3
J16 J17 = Mechanical:HDR-1X1
JP1 JP3 JP4 = Mechanical:JPR-1X3
JP2 JP5 = Mechanical:JPR-1X2
LD1-LD5 = Discrete:LED: Discrete LED
LOGO1 = Logo:ROHS-CHINA: Chinese ROHS symbol logo
LOGO2 = Logo:WEEE: WEEE Symbol
LOGO4 = Logo:MAX32_LOGO: Microchip chipKIT Max32 Logo
LOGO5 = Logo:CHIPKIT: Microchip chipKIT Logo
LOGO6 = Logo:CE: European Union CE Logo
LOGO7 = Logo:DIGILENT_INC
Q1 = Discrete:FDN340P: Single P-channel, Logic Level, Power MOSFET
Q2 = Discrete:MBT3904DW1T1: On-Semiconductor MBT3904DW1T1 Dual General Purpose Transistors
R1-R44 = Discrete:RES: Resistor
X1 = Discrete:XTAL: Quartz Crystal